# Altium schematic sheet [00] - Top Sheet.SchDoc
size A3; Address1: III. Physikalisches Institut B; Address2: RWTH Aachen University; Address3: Otto-Blumenthal-Strasse; Address4: 52074 Aachen, GERMANY; DocumentNumber: 1; SheetNumber: 1; SheetTotal: 6
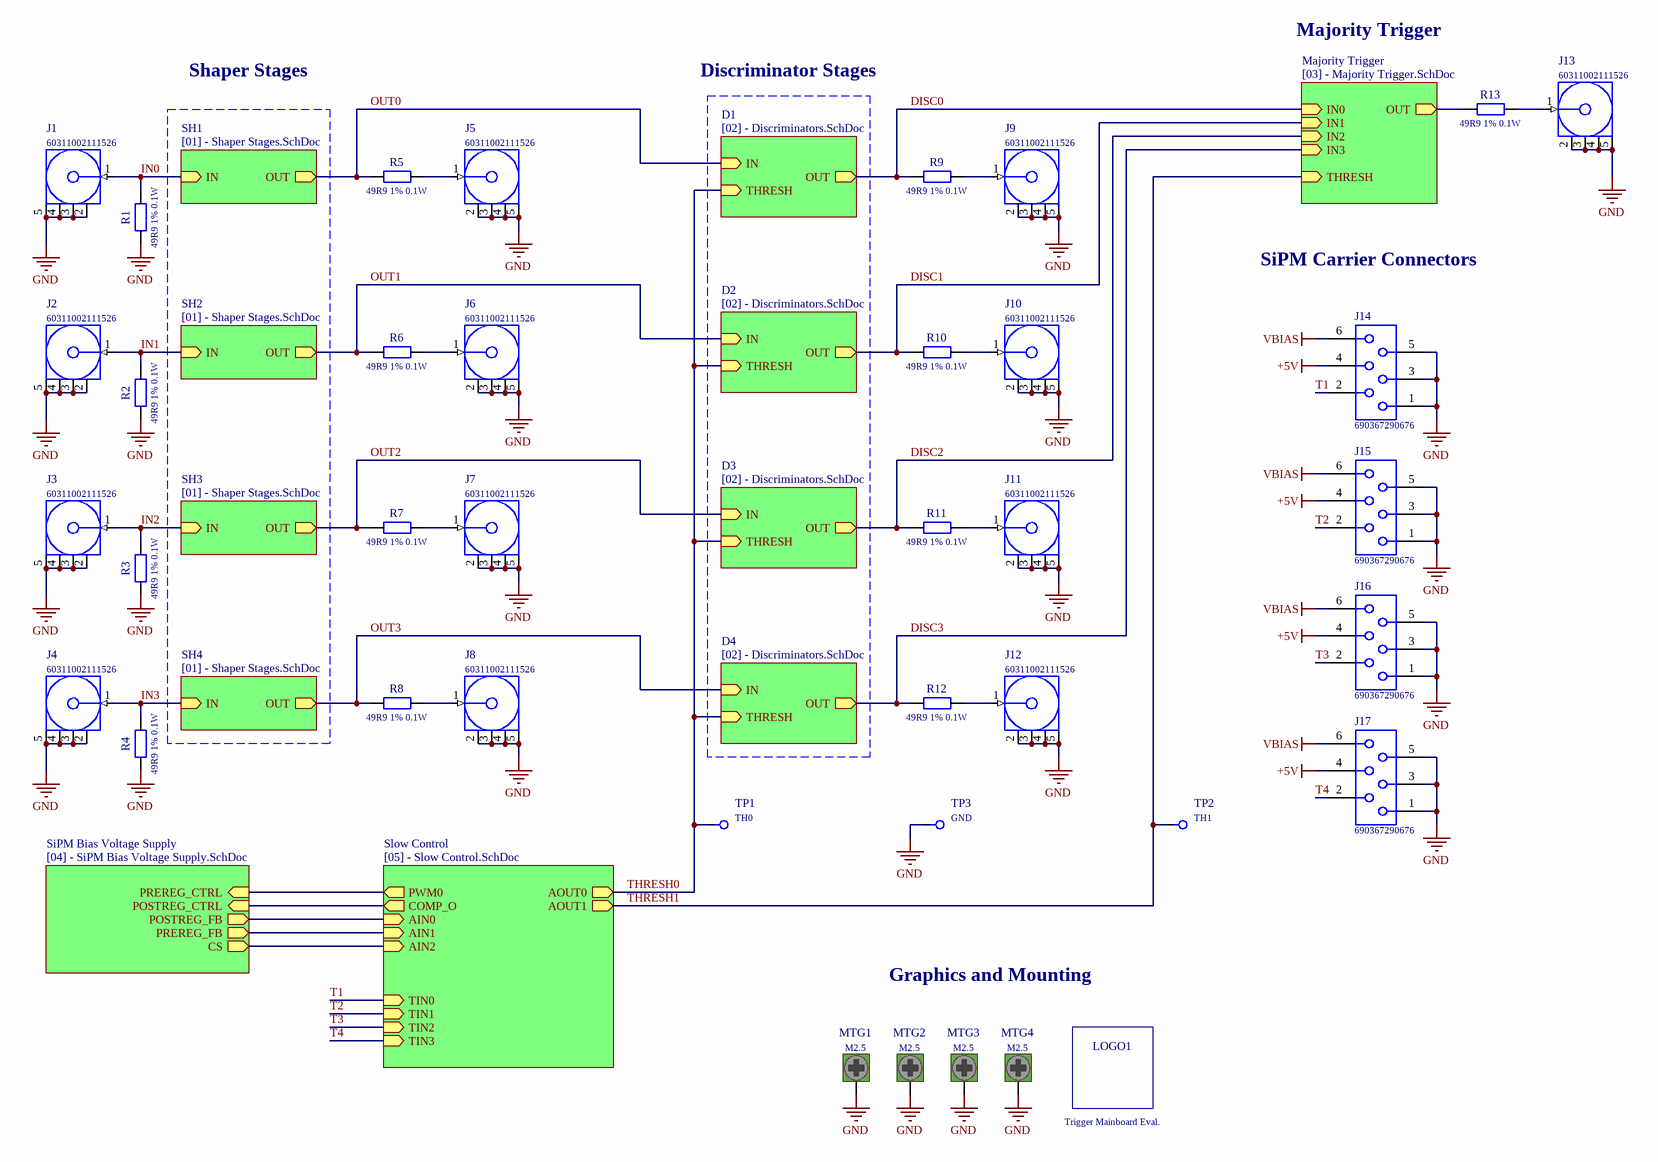
[diagram p0: [00] - Top Sheet.SchDoc]

## Parts
J1  60311002111526  [60311002111526]
J2  60311002111526  [60311002111526]
J3  60311002111526  [60311002111526]
J4  60311002111526  [60311002111526]
J5  60311002111526  [60311002111526]
J6  60311002111526  [60311002111526]
J7  60311002111526  [60311002111526]
J8  60311002111526  [60311002111526]
J9  60311002111526  [60311002111526]
J10  60311002111526  [60311002111526]
J11  60311002111526  [60311002111526]
J12  60311002111526  [60311002111526]
J13  60311002111526  [60311002111526]
J14  690367290676  [690367290676]
J15  690367290676  [690367290676]
J16  690367290676  [690367290676]
J17  690367290676  [690367290676]
LOGO1  Trigger Mainboard Eval.  [RWTH_LOGO_4x15MM]  (no BOM)
MTG1  M2.5  [Mounting_Hole_M2.5]  (no BOM)
MTG2  M2.5  [Mounting_Hole_M2.5]  (no BOM)
MTG3  M2.5  [Mounting_Hole_M2.5]  (no BOM)
MTG4  M2.5  [Mounting_Hole_M2.5]  (no BOM)
R1  49R9 1% 0.1W  [0603_RES]
R2  49R9 1% 0.1W  [0603_RES]
R3  49R9 1% 0.1W  [0603_RES]
R4  49R9 1% 0.1W  [0603_RES]
R5  49R9 1% 0.1W  [0603_RES]
R6  49R9 1% 0.1W  [0603_RES]
R7  49R9 1% 0.1W  [0603_RES]
R8  49R9 1% 0.1W  [0603_RES]
R9  49R9 1% 0.1W  [0603_RES]
R10  49R9 1% 0.1W  [0603_RES]
R11  49R9 1% 0.1W  [0603_RES]
R12  49R9 1% 0.1W  [0603_RES]
R13  49R9 1% 0.1W  [0603_RES]
TP1  TH0  [Testpoint_5002]
TP2  TH1  [Testpoint_5002]
TP3  GND  [Testpoint_5001]

## Sub-sheets
D1 = [02] - Discriminators.SchDoc: IN (in), OUT (out), THRESH (in)
D2 = [02] - Discriminators.SchDoc: IN (in), OUT (out), THRESH (in)
D3 = [02] - Discriminators.SchDoc: IN (in), OUT (out), THRESH (in)
D4 = [02] - Discriminators.SchDoc: IN (in), OUT (out), THRESH (in)
Majority Trigger = [03] - Majority Trigger.SchDoc: IN0 (in), OUT (out), THRESH (in), IN2 (in), IN3 (in), IN1 (in)
SH1 = [01] - Shaper Stages.SchDoc: IN (in), OUT (out)
SH2 = [01] - Shaper Stages.SchDoc: IN (in), OUT (out)
SH3 = [01] - Shaper Stages.SchDoc: IN (in), OUT (out)
SH4 = [01] - Shaper Stages.SchDoc: IN (in), OUT (out)
SiPM Bias Voltage Supply = [04] - SiPM Bias Voltage Supply.SchDoc: PREREG_FB (out), CS (out), PREREG_CTRL (in), POSTREG_FB (out), POSTREG_CTRL (in)
Slow Control = [05] - Slow Control.SchDoc: TIN0 (in), TIN1 (in), TIN2 (in), TIN3 (in), PWM0 (out), AOUT0 (out), AOUT1 (out), AIN0 (in), AIN1 (in), COMP_O (out), AIN2 (in)

## Nets
+5V: J14.4 J15.4 J16.4 J17.4
GND: J1.2(GND) J1.3(GND) J1.4(GND) J1.5(GND) J2.2(GND) J2.3(GND) J2.4(GND) J2.5(GND) J3.2(GND) J3.3(GND) J3.4(GND) J3.5(GND) J4.2(GND) J4.3(GND) J4.4(GND) J4.5(GND) J5.2(GND) J5.3(GND) J5.4(GND) J5.5(GND) J6.2(GND) J6.3(GND) J6.4(GND) J6.5(GND) J7.2(GND) J7.3(GND) J7.4(GND) J7.5(GND) J8.2(GND) J8.3(GND) J8.4(GND) J8.5(GND) J9.2(GND) J9.3(GND) J9.4(GND) J9.5(GND) J10.2(GND) J10.3(GND) J10.4(GND) J10.5(GND) J11.2(GND) J11.3(GND) J11.4(GND) J11.5(GND) J12.2(GND) J12.3(GND) J12.4(GND) J12.5(GND) J13.2(GND) J13.3(GND) J13.4(GND) J13.5(GND) J14.1 J14.3 J14.5 J15.1 J15.3 J15.5 J16.1 J16.3 J16.5 J17.1 J17.3 J17.5 MTG1.1 MTG2.1 MTG3.1 MTG4.1 R1.2 R2.2 R3.2 R4.2 TP3.1
VBIAS: J14.6 J15.6 J16.6 J17.6
DISC0: R9.2 ; sheet D1/OUT, sheet Majority Trigger/IN0
DISC1: R10.2 ; sheet Majority Trigger/IN1, sheet D2/OUT
DISC2: R11.2 ; sheet Majority Trigger/IN2, sheet D3/OUT
DISC3: R12.2 ; sheet Majority Trigger/IN3, sheet D4/OUT
IN0: J1.1(Signal) R1.1 ; sheet SH1/IN
IN1: J2.1(Signal) R2.1 ; sheet SH2/IN
IN2: J3.1(Signal) R3.1 ; sheet SH3/IN
IN3: J4.1(Signal) R4.1 ; sheet SH4/IN
OUT0: R5.2 ; sheet SH1/OUT, sheet D1/IN
OUT1: R6.2 ; sheet SH2/OUT, sheet D2/IN
OUT2: R7.2 ; sheet SH3/OUT, sheet D3/IN
OUT3: R8.2 ; sheet SH4/OUT, sheet D4/IN
T1: J14.2 ; sheet Slow Control/TIN0
T2: J15.2 ; sheet Slow Control/TIN1
T3: J16.2 ; sheet Slow Control/TIN2
T4: J17.2 ; sheet Slow Control/TIN3
THRESH0: TP1.1 ; sheet Slow Control/AOUT0, sheet D1/THRESH, sheet D2/THRESH, sheet D3/THRESH, sheet D4/THRESH
THRESH1: TP2.1 ; sheet Slow Control/AOUT1, sheet Majority Trigger/THRESH
NetJ5_1: J5.1(Signal) R5.1
NetJ6_1: J6.1(Signal) R6.1
NetJ7_1: J7.1(Signal) R7.1
NetJ8_1: J8.1(Signal) R8.1
NetJ9_1: J9.1(Signal) R9.1
NetJ10_1: J10.1(Signal) R10.1
NetJ11_1: J11.1(Signal) R11.1
NetJ12_1: J12.1(Signal) R12.1
NetJ13_1: J13.1(Signal) R13.1
NetR13_2: R13.2 ; sheet Majority Trigger/OUT
(unnamed): sheet Slow Control/PWM0, sheet SiPM Bias Voltage Supply/PREREG_CTRL
(unnamed): sheet Slow Control/AIN0, sheet SiPM Bias Voltage Supply/POSTREG_FB
(unnamed): sheet Slow Control/AIN1, sheet SiPM Bias Voltage Supply/PREREG_FB
(unnamed): sheet Slow Control/COMP_O, sheet SiPM Bias Voltage Supply/POSTREG_CTRL
(unnamed): sheet Slow Control/AIN2, sheet SiPM Bias Voltage Supply/CS

## Notes on the sheet
- Majority Trigger
- Shaper Stages
- Discriminator Stages
- SiPM Carrier Connectors
- Graphics and Mounting
- TITLE
- REVISION
- PROJECT
- AUTHOR
- DESC.
- DATE
- SHEET
- OF

## Library data of the parts
J1-J13 = 60311002111526: WR-SMA PCB Jack, THT, Right Angle; Manufacturer: Wurth Elektronik; Impedance: 50Ohm; Frequency Range: DC~6GHz; Interface: MIL-STD-348; Center Contact Diameter: 1.27mm; ComponentLink1Description: Manufacturer; ComponentLink1URL: http://www.we-online.de; ComponentLink2Description: Datasheet; ComponentLink2URL: https://katalog.we-online.com/em/datasheet/60311002111526.pdf; PartNumber: 60311002111526; Published Date: May 2019; Operating Temperature: -65 to +165degC; Gender: Jack; Packaging: Tray; PackageReference: SMA; Mounting Technology: THT; Orientation Type: Right Angle
J14-J17 = 690367290676: WR-MM MiniModule Connector, Female, SMT, Vertical, pitch 2.54mm, 6pins; Manufacturer: Wurth Elektronik; Pin Number: 6; Insulation Resistance: >1000MOhm; Rated Current: 1.5A; Working Voltage: 100VAC; Withstanding Voltage: 500VAC; Contact Resistance: 10mOhm; ComponentLink1Description: Manufacturer; ComponentLink1URL: http://www.we-online.de; ComponentLink2Description: Datasheet; ComponentLink2URL: https://katalog.we-online.de/em/datasheet/690367290676.pdf; PartNumber: 690367290676; Published Date: June 2019; Pitch: 2.54mm; Operating Temperature: -40 to +105degC; Mounting Technology: SMT; Packaging: Tape and Reel; Gender: Female; Orientation: Vertical; PackageReference: WR-MM
LOGO1 = Logo: Logo Spaceholder.; Manufacturer: RWTH; Value: Trigger Mainboard Eval.
MTG1-MTG4 = Mounting_Hole: Simple mounting hole.; Value: M2.5
R1-R13 = Resistor: Simple generic resistor.; PackageReference: 0603; Value: 49R9 1% 0.1W
TP1-TP3 = Testpoint: Red PC Test Point, Miniature Phosphor Bronze, Silver Plating 0.040" (1.02mm) Hole Diameter Mounting Type.; Manufacturer: Keystone Electronics; PartNumber: 500X; PackageReference: Test Point
  TP1: Value: TH0
  TP2: Value: TH1
  TP3: Value: GND